# EAGLE schematic ENC_MPX_V0.1 (EAGLE 9.5.2)
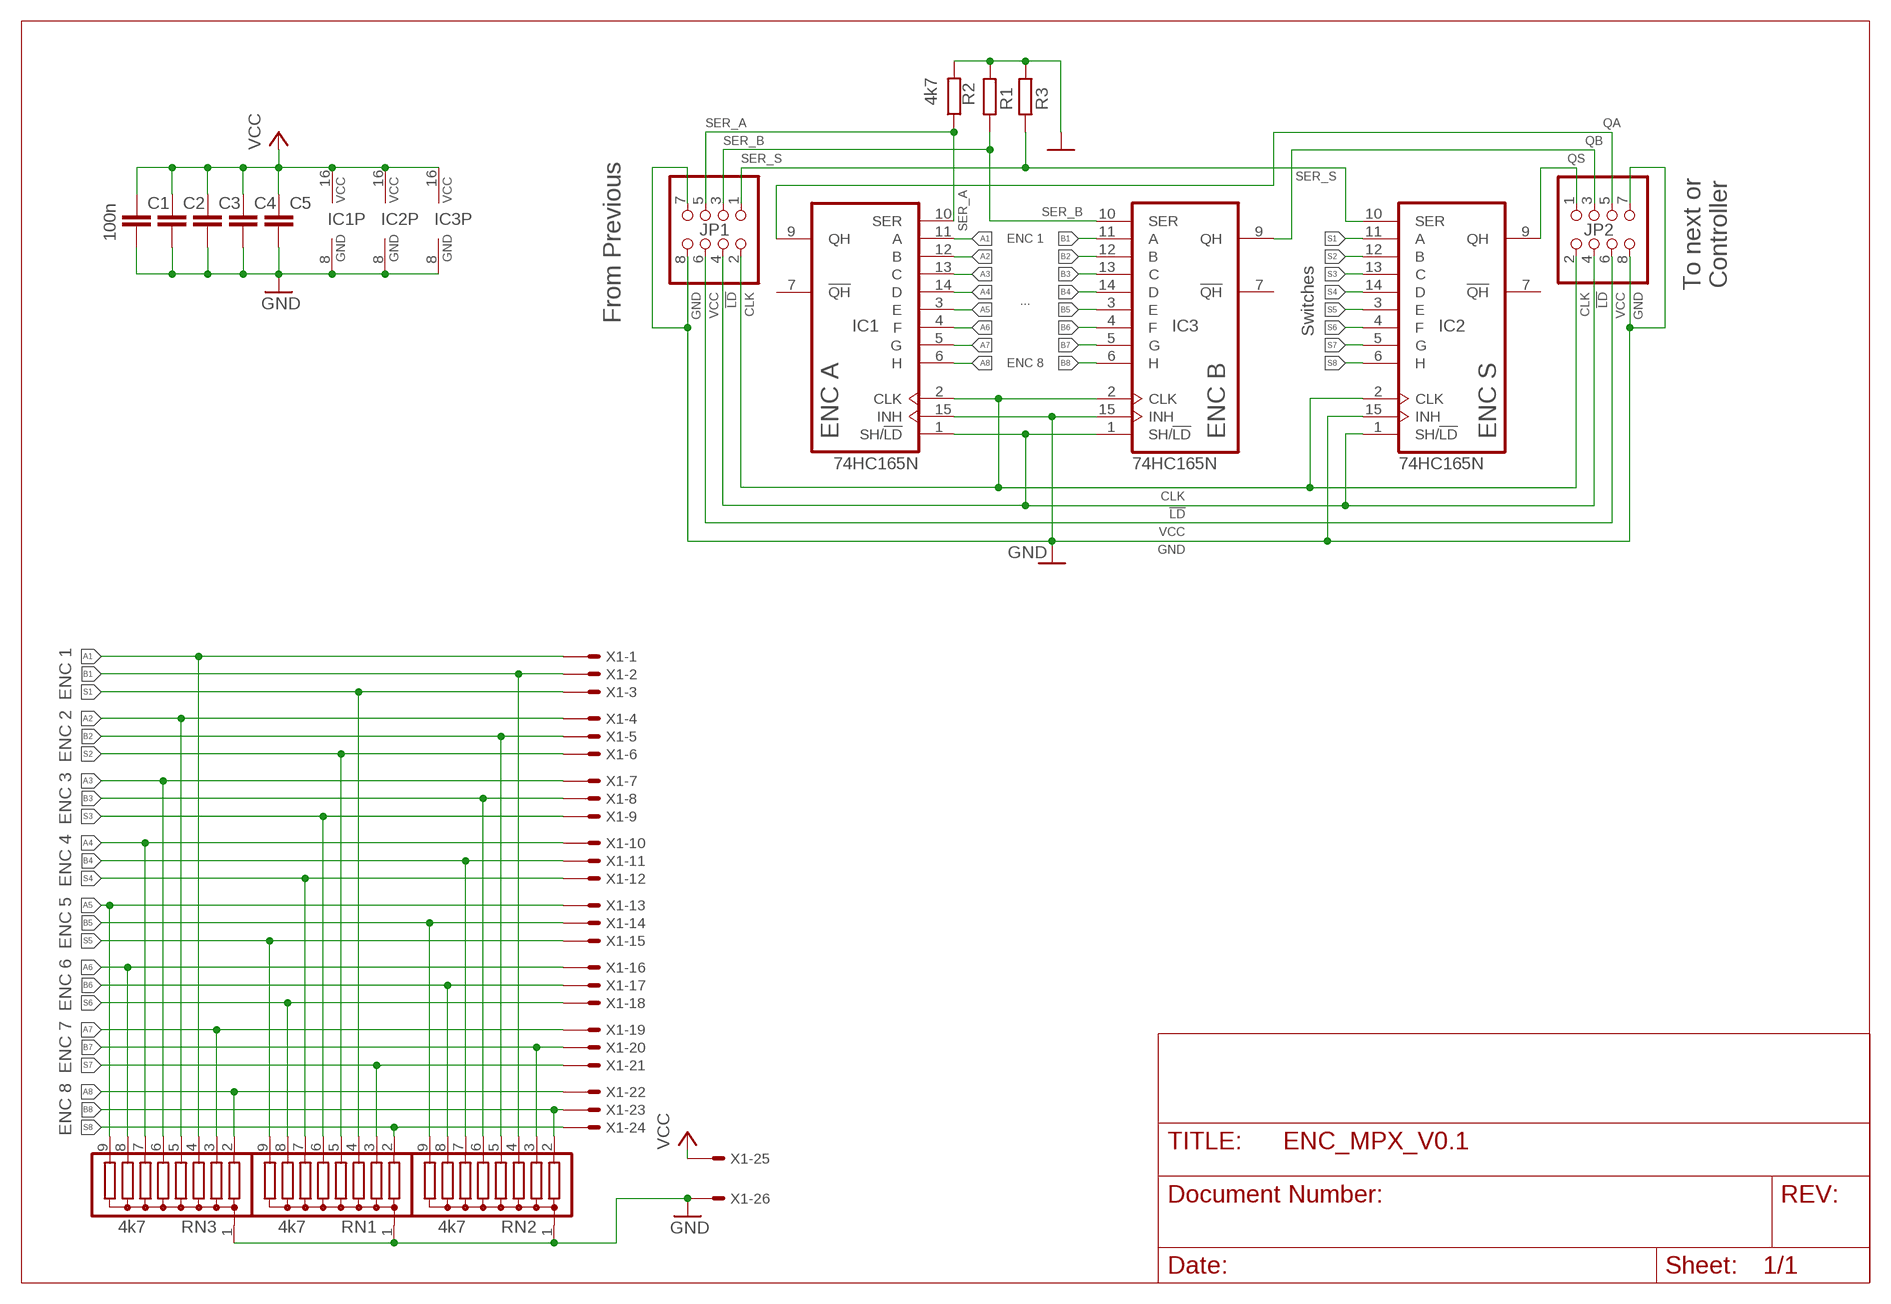
[diagram p0: schematic, sheet 1]

## Parts
C1  100n  C-EU025-025X050  [C025-025X050]
C2  100n  C-EU025-025X050  [C025-025X050]
C3  100n  C-EU025-025X050  [C025-025X050]
C4  100n  C-EU025-025X050  [C025-025X050]
C5  100n  C-EU025-025X050  [C025-025X050]
IC1  74HC165N  [DIL16]
IC2  74HC165N  [DIL16]
IC3  74HC165N  [DIL16]
JP1  PINHD-2X4  [2X04]
JP2  PINHD-2X4  [2X04]
R1  4k7  R-EU_0204/7  [0204/7]
R2  4k7  R-EU_0204/7  [0204/7]
R3  4k7  R-EU_0204/7  [0204/7]
RN1  4k7  G08R  [SIL9]
RN2  4k7  G08R  [SIL9]
RN3  4k7  G08R  [SIL9]
X1  057-026-1  [057-026-1]

## Nets
!LD: IC1.1(SH/!LD) IC2.1(SH/!LD) IC3.1(SH/!LD) JP1.4 JP2.4
A1: IC1.11(A) RN3.4 X1.1
A2: IC1.12(B) RN3.5 X1.4
A3: IC1.13(C) RN3.6 X1.7
A4: IC1.14(D) RN3.7 X1.10
A5: IC1.3(E) RN3.9 X1.13
A6: IC1.4(F) RN3.8 X1.16
A7: IC1.5(G) RN3.3 X1.19
A8: IC1.6(H) RN3.2 X1.22
B1: IC3.11(A) RN2.4 X1.2
B2: IC3.12(B) RN2.5 X1.5
B3: IC3.13(C) RN2.6 X1.8
B4: IC3.14(D) RN2.7 X1.11
B5: IC3.3(E) RN2.9 X1.14
B6: IC3.4(F) RN2.8 X1.17
B7: IC3.5(G) RN2.3 X1.20
B8: IC3.6(H) RN2.2 X1.23
CLK: IC1.2(CLK) IC2.2(CLK) IC3.2(CLK) JP1.2 JP2.2
GND [supply]: C1.2 C2.2 C3.2 C4.2 C5.2 IC1.8(GND) IC1.15(INH) IC2.8(GND) IC2.15(INH) IC3.8(GND) IC3.15(INH) JP1.7 JP1.8 JP2.7 JP2.8 R1.1 R2.2 R3.1 RN1.1 RN2.1 RN3.1 X1.26
QA: IC1.9(QH) JP2.5
QB: IC3.9(QH) JP2.3
QS: IC2.9(QH) JP2.1
S1: IC2.11(A) RN1.4 X1.3
S2: IC2.12(B) RN1.5 X1.6
S3: IC2.13(C) RN1.6 X1.9
S4: IC2.14(D) RN1.7 X1.12
S5: IC2.3(E) RN1.9 X1.15
S6: IC2.4(F) RN1.8 X1.18
S7: IC2.5(G) RN1.3 X1.21
S8: IC2.6(H) RN1.2 X1.24
SER_A: IC1.10(SER) JP1.5 R2.1
SER_B: IC3.10(SER) JP1.3 R1.2
SER_S: IC2.10(SER) JP1.1 R3.2
VCC [supply]: C1.1 C2.1 C3.1 C4.1 C5.1 IC1.16(VCC) IC2.16(VCC) IC3.16(VCC) JP1.6 JP2.6 X1.25
Unconnected: IC1.7(!QH) IC2.7(!QH) IC3.7(!QH)

## Notes on the sheet
- To next or
  Controller
- ENC 1
- ...
- From Previous
- Switches
- ENC 8
- ENC A | ENC B | ENC S
- ENC 1
- ENC 2
- ENC 3
- ENC 4
- ENC 5
- ENC 6
- ENC 7
- ENC 8

## Library data of the parts
C1-C5 = rcl:C-EU: CAPACITOR, European symbol; SPICEPREFIX: C
IC1-IC3 = 74xx-eu:74*165: 8-bit parallel load SHIFT REGISTER
JP1 JP2 = pinhead:PINHD-2X4: PIN HEADER
R1-R3 = rcl:R-EU_: RESISTOR, European symbol; SPICEPREFIX: R
RN1-RN3 = resistor-sil:G08R: SIL RESISTOR; OC_FARNELL: unknown; OC_NEWARK: unknown
X1 = con-panduit:057-026-: CONNECTOR 20-pin series 057 contact pc board low profile headers; OC_FARNELL: unknown; OC_NEWARK: unknown

## Net classes
1 supply: width 0.305 mm